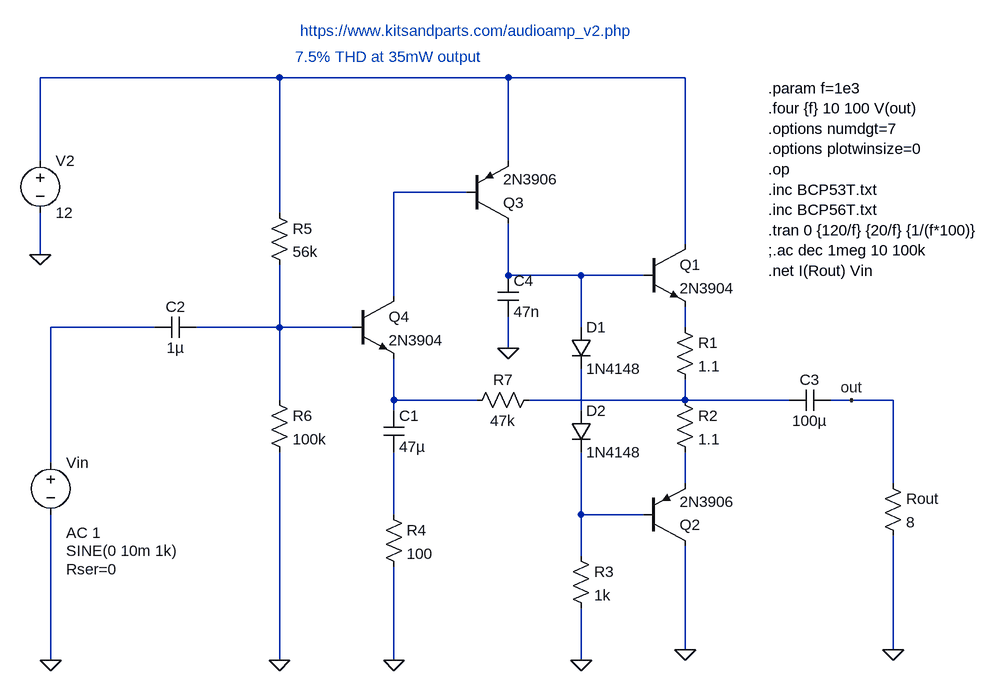
[diagram p0: schematic kits_and_parts.asc]
kits_and_parts.asc, the LTspice schematic file:
Version 4
SHEET 1 880 724
WIRE -352 -192 -720 -192
WIRE 0 -192 -352 -192
WIRE 272 -192 0 -192
WIRE -720 -64 -720 -192
WIRE 0 -64 0 -192
WIRE -64 -16 -176 -16
WIRE -352 16 -352 -192
WIRE 272 64 272 -192
WIRE -720 80 -720 16
WIRE 0 112 0 32
WIRE 112 112 0 112
WIRE 208 112 112 112
WIRE -176 144 -176 -16
WIRE -544 192 -704 192
WIRE -352 192 -352 96
WIRE -352 192 -480 192
WIRE -240 192 -352 192
WIRE 112 192 112 112
WIRE 272 192 272 160
WIRE 0 224 0 176
WIRE -352 304 -352 192
WIRE -176 304 -176 240
WIRE -48 304 -176 304
WIRE 272 304 272 272
WIRE 272 304 32 304
WIRE 432 304 272 304
WIRE 528 304 496 304
WIRE 592 304 528 304
WIRE -176 320 -176 304
WIRE 112 320 112 256
WIRE -704 400 -704 192
WIRE 272 432 272 384
WIRE 592 432 592 304
WIRE -176 480 -176 384
WIRE 112 480 112 384
WIRE 208 480 112 480
WIRE 112 544 112 480
WIRE 272 688 272 528
WIRE 592 688 592 512
WIRE -704 704 -704 480
WIRE -352 704 -352 384
WIRE -176 704 -176 560
WIRE 112 704 112 624
FLAG 272 688 0
FLAG 112 704 0
FLAG -176 704 0
FLAG -352 704 0
FLAG -704 704 0
FLAG -720 80 0
FLAG 592 688 0
FLAG 528 304 out
FLAG 0 224 0
DATAFLAG 352 304 ""
SYMBOL npn 208 64 R0
SYMATTR InstName Q1
SYMATTR Value 2N3904
SYMBOL res 256 176 R0
SYMATTR InstName R1
SYMATTR Value 1.1
SYMBOL res 256 288 R0
SYMATTR InstName R2
SYMATTR Value 1.1
SYMBOL pnp 208 528 M180
SYMATTR InstName Q2
SYMATTR Value 2N3906
SYMBOL diode 96 192 R0
SYMATTR InstName D1
SYMATTR Value 1N4148
SYMBOL diode 96 320 R0
SYMATTR InstName D2
SYMATTR Value 1N4148
SYMBOL res 96 528 R0
SYMATTR InstName R3
SYMATTR Value 1k
SYMBOL pnp -64 32 M180
SYMATTR InstName Q3
SYMATTR Value 2N3906
SYMBOL npn -240 144 R0
SYMATTR InstName Q4
SYMATTR Value 2N3904
SYMBOL cap -192 320 R0
SYMATTR InstName C1
SYMATTR Value 47µ
SYMBOL res -192 464 R0
SYMATTR InstName R4
SYMATTR Value 100
SYMBOL res -368 0 R0
SYMATTR InstName R5
SYMATTR Value 56k
SYMBOL res -368 288 R0
SYMATTR InstName R6
SYMATTR Value 100k
SYMBOL cap -480 176 R90
WINDOW 0 0 32 VBottom 2
WINDOW 3 32 32 VTop 2
SYMATTR InstName C2
SYMATTR Value 1µ
SYMBOL voltage -720 -80 R0
SYMATTR InstName V2
SYMATTR Value 12
SYMBOL res 48 288 R90
WINDOW 0 0 56 VBottom 2
WINDOW 3 32 56 VTop 2
SYMATTR InstName R7
SYMATTR Value 47k
SYMBOL cap 496 288 R90
WINDOW 0 0 32 VBottom 2
WINDOW 3 32 32 VTop 2
SYMATTR InstName C3
SYMATTR Value 100µ
SYMBOL res 576 416 R0
SYMATTR InstName Rout
SYMATTR Value 8
SYMBOL voltage -704 384 R0
WINDOW 3 24 152 Left 2
WINDOW 123 24 124 Left 2
WINDOW 39 24 180 Left 2
SYMATTR Value SINE(0 10m 1k)
SYMATTR Value2 AC 1
SYMATTR SpiceLine Rser=0
SYMATTR InstName Vin
SYMBOL cap -16 112 R0
SYMATTR InstName C4
SYMATTR Value 47n
TEXT 400 -176 Left 2 !.param f=1e3\n.four {f} 10 100 V(out)\n.options numdgt=7\n.options plotwinsize=0\n.op\n.inc BCP53T.txt\n.inc BCP56T.txt\n.tran 0 {120/f} {20/f} {1/(f*100)}\n;.ac dec 1meg 10 100k\n.net I(Rout) Vin
TEXT -320 -264 Left 2 ;https://www.kitsandparts.com/audioamp_v2.php
TEXT -328 -224 Left 2 ;7.5% THD at 35mW output

The netlist it stands for:
* kits_and_parts.asc
Q1 N001 N003 N006 0 2N3904
R1 N006 N008 1.1
R2 N008 N010 1.1
Q2 0 N012 N010 0 2N3906
D1 N003 N009 1N4148
D2 N009 N012 1N4148
R3 N012 0 1k
Q3 N003 N002 N001 0 2N3906
Q4 N002 N005 N007 0 2N3904
C1 N007 N011 47µ
R4 N011 0 100
R5 N001 N005 56k
R6 N005 0 100k
C2 N005 N004 1µ
V2 N001 0 12
R7 N008 N007 47k
C3 out N008 100µ
Rout out 0 8
Vin N004 0 SINE(0 10m 1k) AC 1 Rser=0
C4 N003 0 47n
.model D D
.lib standard.dio
.model NPN NPN
.model PNP PNP
.lib standard.bjt
.param f=1e3
.four {f} 10 100 V(out)
.options numdgt=7
.options plotwinsize=0
.op
.inc BCP53T.txt
.inc BCP56T.txt
.tran 0 {120/f} {20/f} {1/(f*100)}
;.ac dec 1meg 10 100k
.net I(Rout) Vin
* https://www.kitsandparts.com/audioamp_v2.php
* 7.5% THD at 35mW output
.backanno
.end